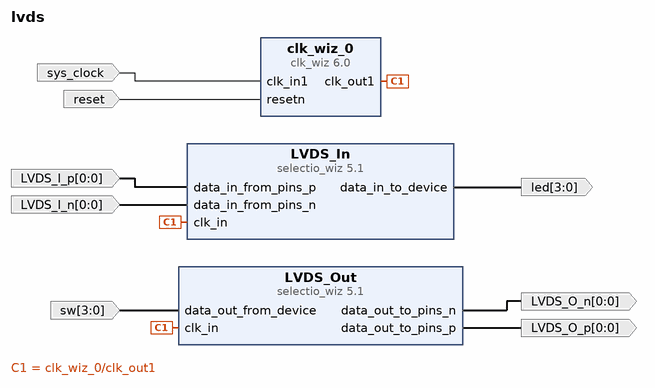
[diagram p0: block diagram of the top level]
# Vivado block design lvds, xc7a100tcsg324-1, Vivado 2019.1
create_bd_design lvds

create_bd_port -dir O -from 3 -to 0 -type data led
create_bd_port -dir I -from 3 -to 0 sw
create_bd_port -dir I -type clk sys_clock
set_property -dict {CONFIG.FREQ_HZ 100000000 CONFIG.PHASE 0.000} [get_bd_ports sys_clock]
create_bd_port -dir I -type rst reset
set_property -dict {CONFIG.POLARITY ACTIVE_LOW} [get_bd_ports reset]
create_bd_port -dir O -from 0 -to 0 LVDS_O_p
create_bd_port -dir O -from 0 -to 0 -type data LVDS_O_n
create_bd_port -dir I -from 0 -to 0 -type data LVDS_I_p
create_bd_port -dir I -from 0 -to 0 -type data LVDS_I_n

create_bd_cell -type ip -vlnv xilinx.com:ip:selectio_wiz:5.1 LVDS_In
set_property -dict [list \
  CONFIG.BUS_IO_STD LVDS_25 \
  CONFIG.BUS_SIG_TYPE DIFF \
  CONFIG.CLK_FWD_IO_STD LVDS_25 \
  CONFIG.CLK_FWD_SIG_TYPE DIFF \
  CONFIG.SELIO_CLK_BUF MMCM \
  CONFIG.SELIO_CLK_IO_STD LVDS_25 \
  CONFIG.SELIO_CLK_SIG_TYPE DIFF \
  CONFIG.SELIO_INTERFACE_TYPE NETWORKING \
  CONFIG.SERIALIZATION_FACTOR 4 \
  CONFIG.SYSTEM_DATA_WIDTH 1 \
  CONFIG.USE_SERIALIZATION true \
] [get_bd_cells LVDS_In]
create_bd_cell -type ip -vlnv xilinx.com:ip:selectio_wiz:5.1 LVDS_Out
set_property -dict [list \
  CONFIG.BUS_DIR OUTPUTS \
  CONFIG.BUS_IO_STD LVDS_25 \
  CONFIG.BUS_SIG_TYPE DIFF \
  CONFIG.CLK_FWD_IO_STD LVDS_25 \
  CONFIG.CLK_FWD_SIG_TYPE DIFF \
  CONFIG.SELIO_BUS_IN_DELAY NONE \
  CONFIG.SELIO_CLK_BUF MMCM \
  CONFIG.SELIO_CLK_IO_STD LVDS_25 \
  CONFIG.SELIO_CLK_SIG_TYPE DIFF \
  CONFIG.SELIO_INTERFACE_TYPE NETWORKING \
  CONFIG.SERIALIZATION_FACTOR 4 \
  CONFIG.SYSTEM_DATA_WIDTH 1 \
  CONFIG.USE_SERIALIZATION true \
] [get_bd_cells LVDS_Out]
create_bd_cell -type ip -vlnv xilinx.com:ip:clk_wiz:6.0 clk_wiz_0
set_property -dict [list \
  CONFIG.CLK_IN1_BOARD_INTERFACE sys_clock \
  CONFIG.RESET_BOARD_INTERFACE reset \
  CONFIG.RESET_PORT resetn \
  CONFIG.RESET_TYPE ACTIVE_LOW \
  CONFIG.USE_BOARD_FLOW true \
] [get_bd_cells clk_wiz_0]

# ---- connections ----

connect_bd_net -net clk_wiz_clk_out1 [get_bd_pins clk_wiz_0/clk_out1] [get_bd_pins LVDS_In/clk_in] [get_bd_pins LVDS_Out/clk_in]
connect_bd_net -net selectio_wiz_0_data_in_to_device [get_bd_pins LVDS_In/data_in_to_device] [get_bd_ports led]
connect_bd_net [get_bd_ports sw] [get_bd_pins LVDS_Out/data_out_from_device]
connect_bd_net [get_bd_ports sys_clock] [get_bd_pins clk_wiz_0/clk_in1]
connect_bd_net [get_bd_ports reset] [get_bd_pins clk_wiz_0/resetn]
connect_bd_net -net LVSD_Out_data_out_to_pins_p [get_bd_pins LVDS_Out/data_out_to_pins_p] [get_bd_ports LVDS_O_p]
connect_bd_net [get_bd_pins LVDS_Out/data_out_to_pins_n] [get_bd_ports LVDS_O_n]
connect_bd_net [get_bd_ports LVDS_I_p] [get_bd_pins LVDS_In/data_in_from_pins_p]
connect_bd_net [get_bd_ports LVDS_I_n] [get_bd_pins LVDS_In/data_in_from_pins_n]

validate_bd_design
save_bd_design
